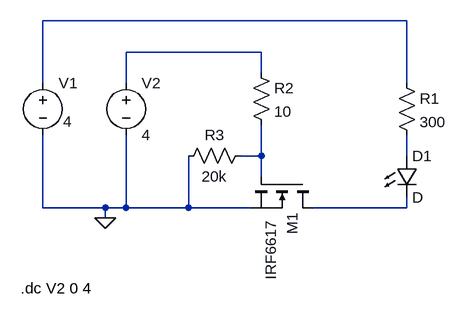
[diagram p0: schematic N Fet neg leg simulation.asc]
N Fet neg leg simulation.asc, the LTspice schematic file:
Version 4
SHEET 1 880 680
WIRE 448 -64 -112 -64
WIRE 224 -16 16 -16
WIRE 224 16 224 -16
WIRE -112 32 -112 -64
WIRE 16 32 16 -16
WIRE 448 32 448 -64
WIRE 224 144 224 96
WIRE 224 144 192 144
WIRE 448 144 448 112
WIRE 224 176 224 144
WIRE -112 224 -112 112
WIRE -16 224 -112 224
WIRE 16 224 16 112
WIRE 16 224 -16 224
WIRE 112 224 112 144
WIRE 112 224 16 224
WIRE 208 224 112 224
WIRE 448 224 448 208
WIRE 448 224 304 224
WIRE -16 240 -16 224
FLAG -16 240 0
SYMBOL voltage -112 16 R0
WINDOW 3 31 75 Left 2
WINDOW 123 0 0 Left 0
WINDOW 39 0 0 Left 0
SYMATTR InstName V1
SYMATTR Value 4
SYMBOL nmos 304 176 R90
WINDOW 3 67 65 Left 2
SYMATTR InstName M1
SYMATTR Value IRF6617
SYMBOL LED 432 144 R0
SYMATTR InstName D1
SYMBOL res 432 16 R0
SYMATTR InstName R1
SYMATTR Value 300
SYMBOL voltage 16 16 R0
WINDOW 123 0 0 Left 0
WINDOW 39 0 0 Left 0
SYMATTR InstName V2
SYMATTR Value 4
SYMBOL res 208 0 R0
SYMATTR InstName R2
SYMATTR Value 10
SYMBOL res 208 128 R90
WINDOW 0 0 56 VBottom 2
WINDOW 3 32 56 VTop 2
SYMATTR InstName R3
SYMATTR Value 20k
TEXT -146 348 Left 2 !.dc V2 0 4

The netlist it stands for:
* N Fet neg leg simulation.asc
V1 N001 0 4
M1 N005 N003 0 0 IRF6617
D1 N004 N005 D
R1 N001 N004 300
V2 N002 0 4
R2 N002 N003 10
R3 N003 0 20k
.model D D
.lib standard.dio
.model NMOS NMOS
.model PMOS PMOS
.lib standard.mos
.dc V2 0 4
.backanno
.end